# Altium project LED_Project.PrjPcb
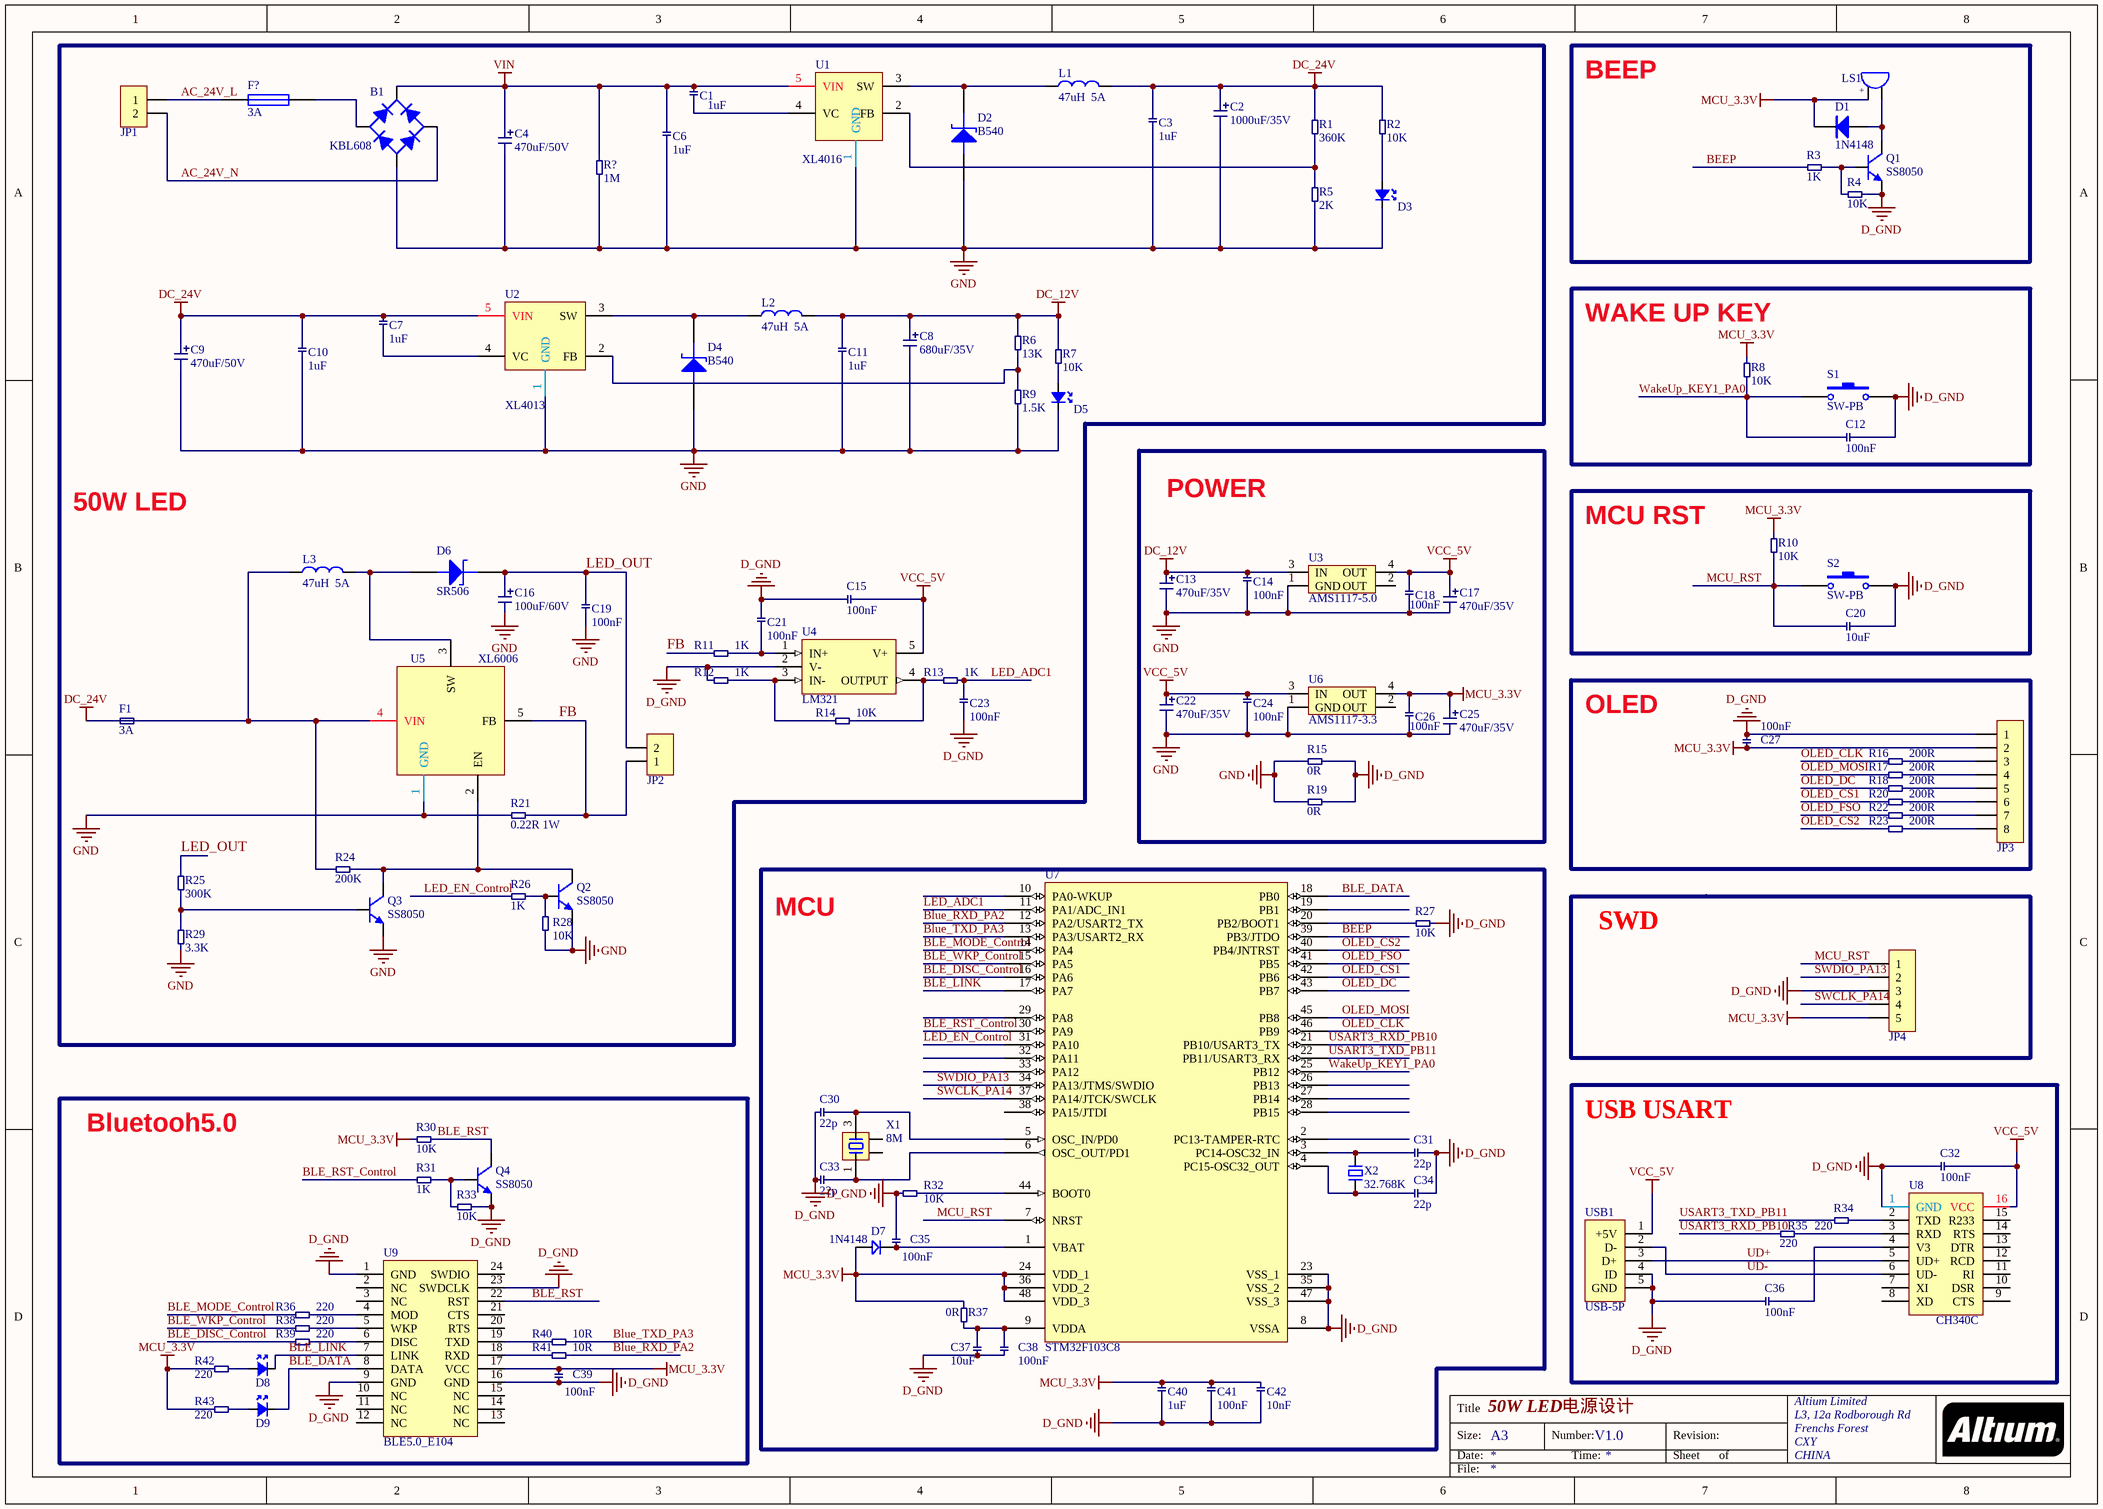
[diagram p0: LED.SchDoc]
1 sheet, 121 parts. Net scope: global (net labels, ports and power ports of the same name join across sheets).
Board file: LED_MainBorad.PcbDoc

## Sheet LED.SchDoc: 50W LED电源设计
size A3; Organization: Altium Limited; Address1: L3, 12a Rodborough Rd; Address2: Frenchs Forest; Address3: CXY; Address4: CHINA; DocumentNumber: V1.0

### Parts
B1  KBL608  [KBL]
C1  1uF  [0805CC]
C2  1000uF/35V  [CAP 5.0*12.5*20]
C3  1uF  [0805CC]
C4  470uF/50V  [CAP 5.0*12.5*20]
C6  1uF  [0805CC]
C7  1uF  [0805CC]
C8  680uF/35V  [CAP 5.0*12.5*20]
C9  470uF/50V  [CAP 5.0*10*16]
C10  1uF  [0805CC]
C11  1uF  [0805CC]
C12  100nF  [0805CC]
C13  470uF/35V  [CD A(3216)]
C14  100nF  [0805CC]
C15  100nF  [0805CC]
C16  100uF/60V  [CAP-10mm]
C17  470uF/35V  [C3216]
C18  100nF  [0805CC]
C19  100nF  [0805CC]
C20  10uF  [0805CC]
C21  100nF  [0805CC]
C22  470uF/35V  [CD A(3216)]
C23  100nF  [0805CC]
C24  100nF  [0805CC]
C25  470uF/35V  [C3216]
C26  100nF  [0805CC]
C27  100nF  [0805CC]
C30  22p  [0805CC]
C31  22p  [0805CC]
C32  100nF  [0805CC]
C33  22p  [0805CC]
C34  22p  [0805CC]
C35  100nF  [0805CC]
C36  100nF  [0805CC]
C37  10uF  [0805CC]
C38  100nF  [0805CC]
C39  100nF  [0805CC]
C40  1uF  [0805CC]
C41  100nF  [0805CC]
C42  10nF  [0805CC]
D1  1N4148  [SOD-323]
D2  B540  [SMCC]
D3  LED  [0805LED]  (value not drawn)
D4  B540  [SMCC]
D5  LED  [0805LED]  (value not drawn)
D6  SR506  [SMCC]
D7  1N4148  [SOD-323]
D8  LED  [0805LED]  (value not drawn)
D9  LED  [0805LED]  (value not drawn)
F1  3A  [FU BLX-A]
F?  3A  [PIN-W2/E2.8]
JP1  HDR-1X2  [XH2.54-LI-2P]  (value not drawn)
JP2  HDR-1X2  [XH2.54-LI-2P]  (value not drawn)
JP3  HDR-1X8  [HDR2.54-M-LI-8P]  (value not drawn)
JP4  HDR-1X5  [HDR2.54-LI-5P]  (value not drawn)
L1  47uH  5A  [LMR135]
L2  47uH  5A  [LMR135]
L3  47uH  5A  [LMR135]
LS1  DC5V  [BEEP 5x9x5.5]  (value not drawn)
Q1  SS8050  [SOT23-3N]
Q2  SS8050  [SOT23-3N]
Q3  SS8050  [SOT23-3N]
Q4  SS8050  [SOT23-3N]
R1  360K  [0805RR]
R2  10K  [0805RR]
R3  1K  [0805RR]
R4  10K  [0805RR]
R5  2K  [0805RR]
R6  13K  [0805RR]
R7  10K  [0805RR]
R8  10K  [0805RR]
R9  1.5K  [0805RR]
R10  10K  [0805RR]
R11  1K  [0805RR]
R12  1K  [0805RR]
R13  1K  [0805RR]
R14  10K  [0805RR]
R15  0R  [0805RR]
R16  200R  [0805RR]
R17  200R  [0805RR]
R18  200R  [0805RR]
R19  0R  [0805RR]
R20  200R  [0805RR]
R21  0.22R 1W  [2512R]
R22  200R  [0805RR]
R23  200R  [0805RR]
R24  200K  [0805RR]
R25  300K  [0805RR]
R26  1K  [0805RR]
R27  10K  [0805RR]
R28  10K  [0805RR]
R29  3.3K  [0805RR]
R30  10K  [0805RR]
R31  1K  [0805RR]
R32  10K  [0805RR]
R33  10K  [0805RR]
R34  220  [0805RR]
R35  220  [0805RR]
R36  220  [0805RR]
R37  0R  [0805RR]
R38  220  [0805RR]
R39  220  [0805RR]
R40  10R  [0805RR]
R41  10R  [0805RR]
R42  220  [0805RR]
R43  220  [0805RR]
R?  1M  [0805RR]
S1  SW-PB  [TSW SMD-6*6*6]
S2  SW-PB  [TSW SMD-4*4*1.5]
U1  XL4016  [TO220-5A]
U2  XL4013  [TO252-5]
U3  AMS1117-5.0  [SOT223_N]
U4  LM321  [SOT23-5]
U5  XL6006  [TO263-5A]
U6  AMS1117-3.3  [SOT223_N]
U7  STM32F103C8  [LQFP48 7X7_M]
U8  CH340C  [SOP16_L]
U9  BLE5.0_E104  [BLE_E104]
USB1  USB-5P  [USB-MICRO_A]
X1  8M  [OSC 3225-4P]
X2  32.768K  [OSC 3215-2P]

### Nets
D_GND: C12.2 C15.2 C20.1 C21.2 C23.2 C27.2 C30.1 C31.2 C32.2 C33.1 C34.2 C35.2 C36.2 C37.1 C38.1 C39.1 C40.1 C41.1 C42.1 JP3.1 JP4.3 Q1.2(E) Q4.2(E) R4.2 R12.2 R15.2 R19.2 R27.2 R32.1 R33.2 S1.2 S2.2 U4.2(V-) U7.8(VSSA) U7.23(VSS_1) U7.35(VSS_2) U7.47(VSS_3) U8.1(GND) U9.1(GND) U9.9(GND) U9.16(GND) U9.23(SWDCLK) USB1.4(ID) USB1.5(GND)
DC_12V: C8.1 C11.2 C13.1 C14.2 L2.1 R6.2 R7.1 U3.3(IN)
DC_24V: C2.1 C3.2 C7.2 C9.1 C10.2 F1.1 L1.1 R1.2 R2.1 U2.5(VIN)
GND: B1.DC- C2.2 C3.1 C4.2 C6.1 C8.2 C9.2 C10.1 C11.1 C13.2 C14.1 C16.2 C17.2 C18.1 C19.1 C22.2 C24.1 C25.2 C26.1 D2.1(A) D3.2(CATHODE) D4.1(A) D5.2(CATHODE) Q2.2(E) Q3.2(E) R5.1 R9.1 R15.1 R19.1 R21.1 R28.2 R29.1 R?.1 U1.1(GND) U2.1(GND) U3.1(GND) U5.1(GND) U6.1(GND)
MCU_3.3V: C25.1 C26.2 C27.1 C39.2 C40.2 C41.2 C42.2 D1.2(K) D7.1 JP3.2 JP4.5 LS1.1 R8.2 R10.2 R30.1 R37.2 R42.1 R43.1 U6.4(OUT) U7.24(VDD_1) U7.36(VDD_2) U7.48(VDD_3) U9.17(VCC)
VCC_5V: C15.1 C17.1 C18.2 C22.1 C24.2 C32.1 U3.4(OUT) U4.5(V+) U6.3(IN) U8.16(VCC) USB1.1(+5V)
VIN: B1.DC+ C1.2 C4.1 C6.2 R?.2 U1.5(VIN)
AC_24V_L: F?.1 JP1.1
AC_24V_N: B1.AC2 JP1.2
BEEP: R3.1 U7.39(PB3/JTDO)
BLE_DATA: D9.2(CATHODE) U7.18(PB0) U9.8(DATA)
BLE_DISC_Control: R39.1 U7.16(PA6)
BLE_LINK: D8.2(CATHODE) U7.17(PA7) U9.7(LINK)
BLE_MODE_Control: R36.1 U7.14(PA4)
BLE_RST: Q4.3(C) R30.2 U9.22(RST)
BLE_RST_Control: R31.1 U7.30(PA9)
BLE_WKP_Control: R38.1 U7.15(PA5)
Blue_RXD_PA2: R41.2 U7.12(PA2/USART2_TX)
Blue_TXD_PA3: R40.2 U7.13(PA3/USART2_RX)
FB: JP2.1 R11.1 R21.2 U5.5(FB)
LED_ADC1: C23.1 R13.1 U7.11(PA1/ADC_IN1)
LED_EN_Control: R26.1 U7.31(PA10)
LED_OUT: C16.1 C19.2 D6.2(K) JP2.2 R25.2
MCU_RST: C20.2 JP4.1 R10.1 S2.1 U7.7(NRST)
OLED_CLK: R16.1 U7.46(PB9)
OLED_CS1: R20.1 U7.42(PB6)
OLED_CS2: R23.1 U7.40(PB4/JNTRST)
OLED_DC: R18.1 U7.43(PB7)
OLED_FSO: R22.1 U7.41(PB5)
OLED_MOSI: R17.1 U7.45(PB8)
SWCLK_PA14: JP4.4 U7.37(PA14/JTCK/SWCLK)
SWDIO_PA13: JP4.2 U7.34(PA13/JTMS/SWDIO)
UD+: U8.5(UD+) USB1.3(D+)
UD-: U8.6(UD-) USB1.2(D-)
USART3_RXD_PB10: R35.1 U7.21(PB10/USART3_TX)
USART3_TXD_PB11: R34.1 U7.22(PB11/USART3_RX)
WakeUp_KEY1_PA0: C12.1 R8.1 S1.1 U7.25(PB12)
NetB1_AC1: B1.AC1 F?.2
NetC1_1: C1.1 U1.4(VC)
NetC7_1: C7.1 U2.4(VC)
NetC21_1: C21.1 R11.2 U4.1(IN+)
NetC30_2: C30.2 U7.5(OSC_IN/PD0) X1.3
NetC31_1: C31.1 U7.3(PC14-OSC32_IN) X2.2
NetC33_2: C33.2 U7.6(OSC_OUT/PD1) X1.1
NetC34_1: C34.1 U7.4(PC15-OSC32_OUT) X2.1
NetC35_1: C35.1 D7.2 U7.1(VBAT)
NetC36_1: C36.1 U8.4(V3)
NetC37_2: C37.2 C38.2 R37.1 U7.9(VDDA)
NetD1_1: D1.1(A) LS1.2 Q1.3(C)
NetD2_2: D2.2(K) L1.2 U1.3(SW)
NetD3_1: D3.1(ANODE) R2.2
NetD4_2: D4.2(K) L2.2 U2.3(SW)
NetD5_1: D5.1(ANODE) R7.2
NetD6_1: D6.1(A) L3.1 U5.3(SW)
NetD8_1: D8.1(ANODE) R42.2
NetD9_1: D9.1(ANODE) R43.2
NetF1_2: F1.2 L3.2 R24.2 U5.4(VIN)
NetJP3_3: JP3.3 R16.2
NetJP3_4: JP3.4 R17.2
NetJP3_5: JP3.5 R18.2
NetJP3_6: JP3.6 R20.2
NetJP3_7: JP3.7 R22.2
NetJP3_8: JP3.8 R23.2
NetQ1_1: Q1.1(B) R3.2 R4.1
NetQ2_1: Q2.1(B) R26.2 R28.1
NetQ2_3: Q2.3(C) Q3.3(C) R24.1 U5.2(EN)
NetQ3_1: Q3.1(B) R25.1 R29.2
NetQ4_1: Q4.1(B) R31.2 R33.1
NetR1_1: R1.1 R5.2 U1.2(FB)
NetR6_1: R6.1 R9.2 U2.2(FB)
NetR12_1: R12.1 R14.2 U4.3(IN-)
NetR13_2: R13.2 R14.1 U4.4(OUTPUT)
NetR27_1: R27.1 U7.20(PB2/BOOT1)
NetR32_2: R32.2 U7.44(BOOT0)
NetR34_2: R34.2 U8.2(TXD)
NetR35_2: R35.2 U8.3(RXD)
NetR36_2: R36.2 U9.4(MOD)
NetR38_2: R38.2 U9.5(WKP)
NetR39_2: R39.2 U9.6(DISC)
NetR40_1: R40.1 U9.19(TXD)
NetR41_1: R41.1 U9.18(RXD)

Not connected (* = marked no-connect by the designer): U3 2(OUT); U6 2(OUT); U7 2(PC13-TAMPER-RTC) 10(PA0-WKUP) 19(PB1) 26(PB13) 27(PB14) 28(PB15) 29(PA8) 32(PA11) 33(PA12) 38(PA15/JTDI); U8 7(XI) 8(XD) 9(CTS) 10(DSR) 11(RI) 12(RCD) 13(DTR) 14(RTS) 15(R233); U9 2(NC) 3(NC) 10(NC) 11(NC) 12(NC) 13(NC) 14(NC) 15(NC) 20(RTS) 21(CTS) 24(SWDIO); X1 2 4

### Notes on the sheet
- BEEP
- (near R8) WAKE UP KEY
- 50W LED
- POWER
- MCU RST
- OLED
- MCU
- SWD
- USB USART
- Bluetooh5.0
- Title
- Size:
- Date:
- A3
- Number:
- Time:
- Revision:
- Sheet
- of
- File:
- (in symbol BEEP) +

### Library data of the parts
B1 = KBL: 600V/8A整流桥; BOM名称: 1KV/2A整流桥; 版权归属: 源创客; 学习资源: www.ooocke.com
C1 C3 C6 C7 C10-C12 C14 C15 C18-C21 C23 C24 C26 C27 C30-C42 = cap
C2 C4 C8 C9 C13 C16 C17 C22 C25 = Ecap
D1 = 1N4148: 高速开关二极管; 版权归属: 源创客; BOM名称: 高速开关二极管; 学习资源: www.ooocke.com
D2 D4 D6 = ZENER2: Zener Diode
D7 = D
F1 = fuse
F? = Fuse 1: Fuse; Published: 8-Jun-2000; LatestRevisionDate: 17-Jul-2002; LatestRevisionNote: Re-released for DXP Platform.; PackageReference: PIN-W2/E2.8; Publisher: Altium Limited; PackageDescription: Thru-Hole; 2 Leads
JP1 JP2 = Header 2: 2P接插件; 版权归属: 源创客; BOM名称: 2P接插件; 学习资源: www.ooocke.com
JP3 = Header 8: 8P接插件; 版权归属: 源创客; BOM名称: 8P接插件; 学习资源: www.ooocke.com
JP4 = Header 5: 5P接插件; 版权归属: 源创客; BOM名称: 5P接插件; 学习资源: www.ooocke.com
L1-L3 = L1: 电感
LS1 = BEEP: 蜂鸣器; 版权归属: 源创客; BOM名称: 蜂鸣器; 学习资源: www.ooocke.com
Q1-Q4 = 8050-SMD: 高频放大-NPN型; 版权归属: 源创客; 属性: 40V 1.5A 1W 100MHZ; BOM名称: 高频放大-NPN型; 学习资源: www.ooocke.com
R1-R43 R? = res
S1 S2 = SW-PB: Switch; Published: 24-Mar-1999; LatestRevisionDate: 17-Jul-2002; LatestRevisionNote: Re-released for DXP Platform.; PackageReference: SPST-2; Publisher: Altium Limited
U3 U6 = AMS1117
U7 = STM32F103C8: Flaah:64/RAM:20/IO:36; BOM名称: 32位STM单片机; 版权归属: 源创客; 学习资源: www.ooocke.com
USB1 = USB-5P: 微型USB母座; 版权归属: 源创客; BOM名称: 微型USB母座; 学习资源: www.ooocke.com
X1 = XTAL-4P: 4脚无源晶振; 版权归属: 源创客; BOM名称: 4脚无源晶振; 学习资源: www.ooocke.com
X2 = XTAL-2P: 2脚无源脚晶振; 版权归属: 源创客; BOM名称: 2脚无源脚晶振; 学习资源: www.ooocke.com